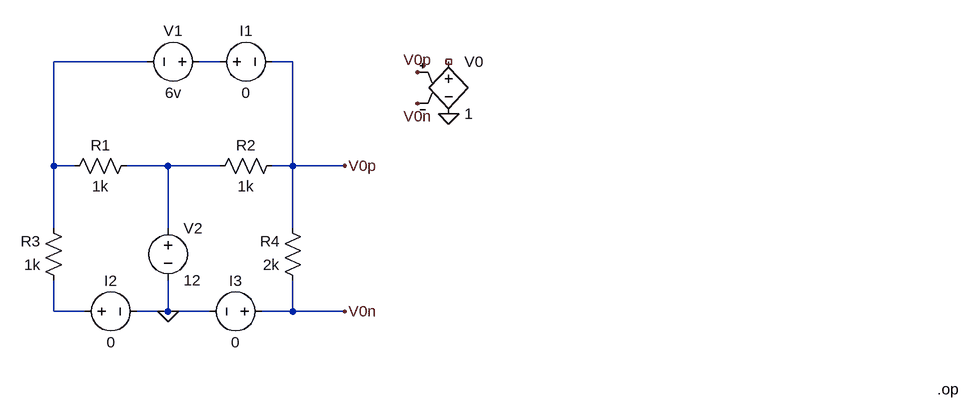
[diagram p0: schematic HW3P01.asc]
HW3P01.asc, the LTspice schematic file:
Version 4
SHEET 1 1416 680
WIRE 160 112 16 112
WIRE 272 112 240 112
WIRE 384 112 352 112
WIRE 16 272 16 112
WIRE 48 272 16 272
WIRE 192 272 128 272
WIRE 272 272 192 272
WIRE 384 272 384 112
WIRE 384 272 352 272
WIRE 464 272 384 272
WIRE 16 368 16 272
WIRE 192 368 192 272
WIRE 384 368 384 272
WIRE 16 496 16 448
WIRE 64 496 16 496
WIRE 192 496 192 448
WIRE 192 496 144 496
WIRE 256 496 192 496
WIRE 384 496 384 448
WIRE 384 496 336 496
WIRE 464 496 384 496
FLAG 464 272 V0p
FLAG 464 496 V0n
FLAG 192 496 0
FLAG 576 128 V0p
FLAG 576 176 V0n
FLAG 624 192 0
SYMBOL voltage 256 112 R90
WINDOW 0 -32 56 VBottom 2
WINDOW 3 32 56 VTop 2
SYMATTR InstName V1
SYMATTR Value 6v
SYMBOL res 144 256 R90
WINDOW 0 0 56 VBottom 2
WINDOW 3 32 56 VTop 2
SYMATTR InstName R1
SYMATTR Value 1k
SYMBOL res 368 256 R90
WINDOW 0 0 56 VBottom 2
WINDOW 3 32 56 VTop 2
SYMATTR InstName R2
SYMATTR Value 1k
SYMBOL res 400 464 R180
WINDOW 0 36 76 Left 2
WINDOW 3 36 40 Left 2
SYMATTR InstName R4
SYMATTR Value 2k
SYMBOL res 32 464 R180
WINDOW 0 36 76 Left 2
WINDOW 3 36 40 Left 2
SYMATTR InstName R3
SYMATTR Value 1k
SYMBOL voltage 192 352 R0
SYMATTR InstName V2
SYMATTR Value 12
SYMBOL e 624 96 R0
SYMATTR InstName V0
SYMATTR Value 1
SYMBOL voltage 256 112 R270
WINDOW 0 32 56 VTop 2
WINDOW 3 -32 56 VBottom 2
SYMATTR InstName I1
SYMATTR Value 0
SYMBOL voltage 352 496 R90
WINDOW 0 -32 56 VBottom 2
WINDOW 3 32 56 VTop 2
SYMATTR InstName I3
SYMATTR Value 0
SYMBOL voltage 48 496 R270
WINDOW 0 32 56 VTop 2
WINDOW 3 -32 56 VBottom 2
SYMATTR InstName I2
SYMATTR Value 0
TEXT 1376 616 Left 2 !.op

The netlist it stands for:
* HW3P01.asc
V1 N002 N001 6v
R1 N003 N001 1k
R2 V0p N003 1k
R4 V0n V0p 2k
R3 N004 N001 1k
V2 N003 0 12
E§V0 NC_01 0 V0p V0n 1
V§I1 N002 V0p 0
V§I3 V0n 0 0
V§I2 N004 0 0
.op
.backanno
.end